# EAGLE design frontend (EAGLE 7.2.0)
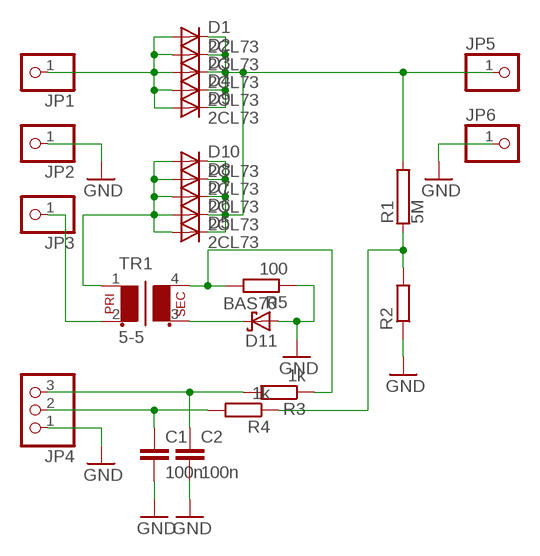
[diagram p0: schematic, sheet 1]

## Parts
C1  100n  C-EUC1206  [C1206]
C2  100n  C-EUC1206  [C1206]
D1  2CL73  [DIODE-3-20]
D2  2CL73  [DIODE-3-20]
D3  2CL73  [DIODE-3-20]
D4  2CL73  [DIODE-3-20]
D5  2CL73  [DIODE-3-20]
D6  2CL73  [DIODE-3-20]
D7  2CL73  [DIODE-3-20]
D8  2CL73  [DIODE-3-20]
D9  2CL73  [DIODE-3-20]
D10  2CL73  [DIODE-3-20]
D11  BAS70  [SOT23]
JP1  PINHD-1X1  [1X01]
JP2  PINHD-1X1  [1X01]
JP3  PINHD-1X1  [1X01]
JP4  PINHD-1X3/90  [1X03/90]
JP5  PINHD-1X1  [1X01]
JP6  PINHD-1X1  [1X01]
R1  5M  RCA4150  [CA4150]
R2  R-EU_R0805  [R0805]
R3  1k  R-EU_R0805  [R0805]
R4  1k  R-EU_R0805  [R0805]
R5  100  R-EU_R0805  [R0805]
TR1  5-5  [RM4-4]

## Nets
GND: C1.2 C2.2 D11.1(A) JP2.1 JP4.1 JP6.1 R2.1 R5.1
N$1: D1.A D2.A D3.A D4.A D9.A JP1.1
N$2: R1.1 R2.2 R4.1
N$3: D5.A D6.A D7.A D8.A D10.A TR1.1
N$4: D1.C D2.C D3.C D4.C D5.C D6.C D7.C D8.C D9.C D10.C JP5.1 R1.2
N$5: C1.1 JP4.2 R4.2
N$6: C2.1 JP4.3 R3.2
N$7: JP3.1 TR1.2
N$8: R3.1 R5.2 TR1.4
N$10: D11.3(C) TR1.3

## Library data of the parts
C1 C2 = resistor:C-EU: CAPACITOR, European symbol
D1-D10 = 50w-modular-psu:2CL*: HIGH VOLTAGE, LOW CURRENT SILICON RECTIFIER DIODES
D11 = diode:BAS70: Silicon Schottky Diodes General-purpose diode for high-speed switching
JP1-JP3 JP5 JP6 = pinhead:PINHD-1X1: PIN HEADER
JP4 = pinhead:PINHD-1X3: PIN HEADER
R1 = resistor-power:R: Power Resitor; OC_FARNELL: unknown; OC_NEWARK: unknown
R2-R5 = resistor:R-EU_: RESISTOR, European symbol
TR1 = 50w-modular-psu:5-5

## Board
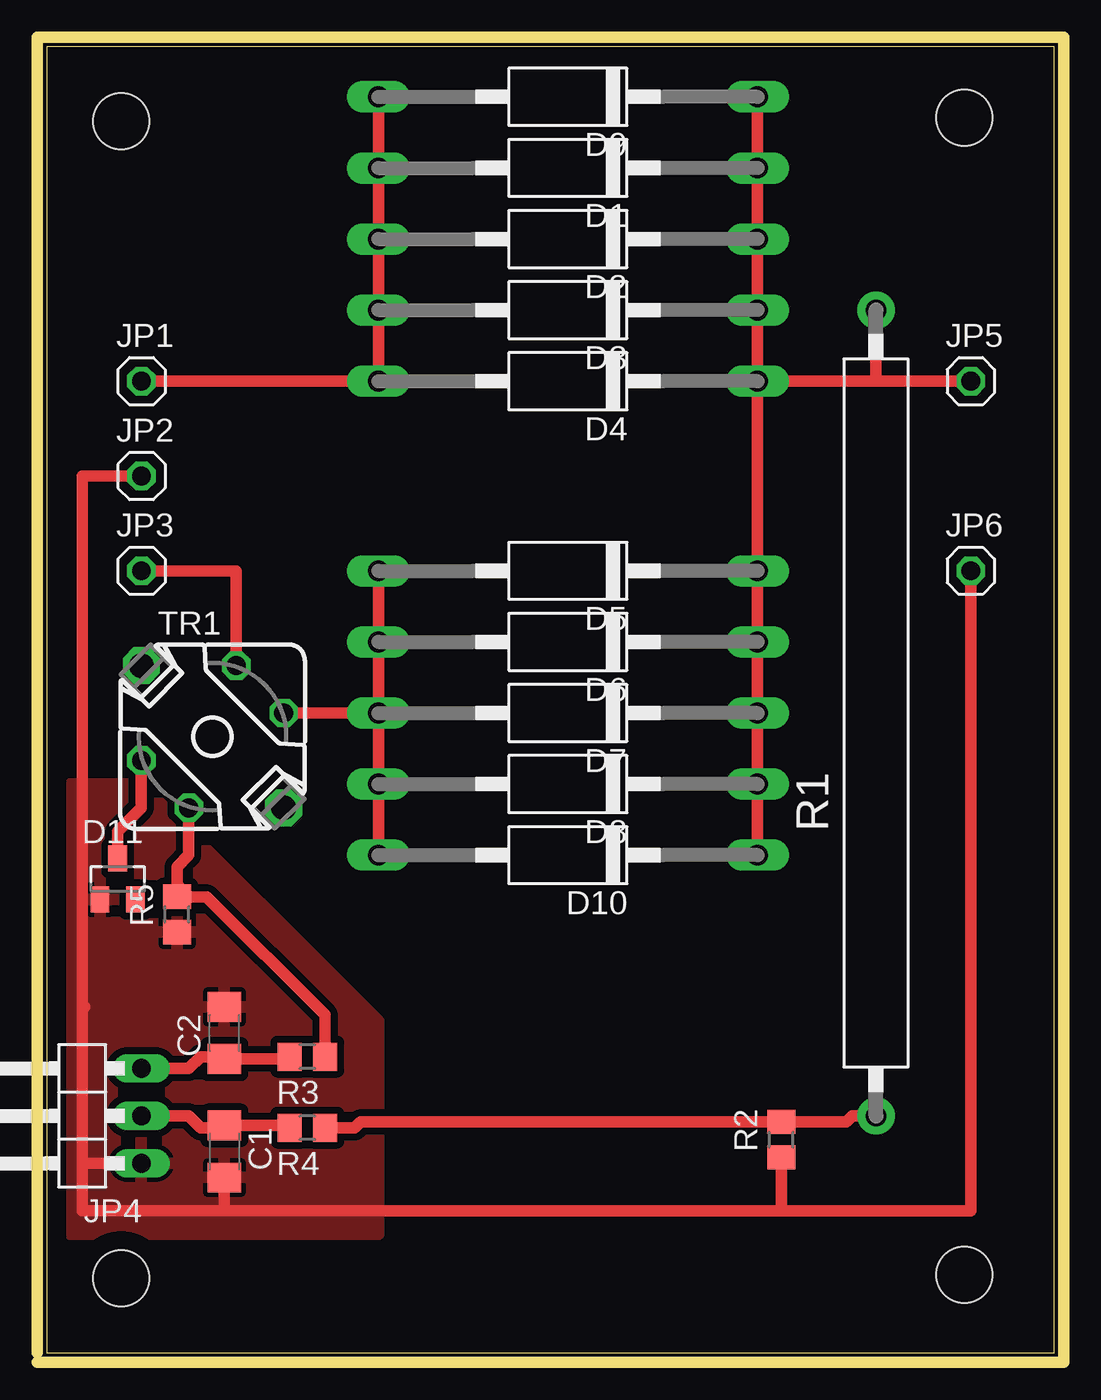
[diagram p1: board, top side]

Size 54 x 70 mm. Coordinates in mm from the lower left corner, seen from the top.
Outline: 0,0 54,0 54,70 0,70 0,0
Copper layers (1*16): Top 0.035mm / dielectric 1.5mm / Bottom 0.035mm
Design rules "default": minimum track width 10mil, minimum drill 24mil, track to track 8mil, track to pad 8mil, pad to pad 8mil, via to via 8mil, smd to smd 8mil, copper to edge 40mil, drill to drill 8mil, minimum pad ring 10mil, minimum via ring 8mil, stop-mask expansion 4mil, vias tented up to drill 0mil, thermal gap 10mil
Holes 3 mm at 4,4 4,66 49.19,4.19 49.19,66.19
Milling: 4 lines

### Footprints (pad centres in the part's own frame; a part is rotated, then mirrored left to right if it is on the bottom)
C1206 = smd 1.6 x 1.8: 1 -1.4,0; 2 1.4,0
DIODE-3-20 = drill 1.118 long: A 10.16,0; C -10.16,0
SOT23 = smd 1 x 1.4: 1 -0.95,-1.1; 2 0.95,-1.1; 3 0,1.1
1X01 = drill 1.016 octagon: 1 0,0
1X03/90 = drill 1.016 long: 1 -2.54,-3.81; 2 0,-3.81; 3 2.54,-3.81
CA4150 = drill 1.1 pad 2: 1 -21.59,0; 2 21.59,0
R0805 = smd 1.3 x 1.5: 1 -0.95,0; 2 0.95,0
RM4-4 = drill 1.016 octagon: 1 -1.27,3.81; 2 -3.81,1.27; 3 1.27,-3.81; 4 3.81,-1.27 | drill 1.321 octagon: M1 -3.81,-3.81; M2 3.81,3.81

### Placement (x,y rotation side)
C1  9.53,10.79 270 top
C2  9.53,17.14 90 top
D1  27.94,63.5 180 top
D2  27.94,59.69 180 top
D3  27.94,55.88 180 top
D4  27.94,52.07 180 top
D5  27.94,41.91 180 top
D6  27.94,38.1 180 top
D7  27.94,34.29 180 top
D8  27.94,30.48 180 top
D9  27.94,67.31 180 top
D10  27.94,26.67 180 top
D11  3.81,25.4 0 top
JP1  5.08,52.07 0 top
JP2  5.08,46.99 0 top
JP3  5.08,41.91 0 top
JP4  1.27,12.7 90 top
JP5  49.53,52.07 0 top
JP6  49.53,41.91 0 top
R1  44.45,34.29 90 top
R2  39.37,11.43 90 top
R3  13.97,15.88 180 top
R4  13.97,12.06 180 top
R5  6.99,23.5 90 top
TR1  8.89,33.02 270 top

### Tracks (layer width: path | path; a pad name or v marks a point on that pad's centre or on a via)
GND
  Top 0.61: 1.91,10.16 1.91,7.62 9.53,7.62 | 1.91,10.16 JP4.1 | JP6.1 49.53,7.62 39.37,7.62 | 39.37,7.62 9.53,7.62 | 1.91,10.16 1.91,18.41 | 1.91,18.41 1.91,46.99 JP2.1 | R2.1 39.37,7.62 | C1.2 9.53,7.62 | 2.04,18.55 1.91,18.41
  pour Top (isolate 0.381): 1.27,6.35 1.27,30.48 5.08,30.48 17.78,17.78 17.78,6.35
N$1
  Top 0.61: JP1.1 D4.A D3.A D2.A D1.A D9.A
N$2
  Top 0.61: R4.1 16.51,12.06 16.82,12.38 R2.2 42.86,12.38 43.18,12.7 R1.1
N$3
  Top 0.61: D5.A D6.A D7.A | D7.A D8.A D10.A | TR1.1 D7.A
N$4
  Top 0.61: D4.C D3.C D2.C D1.C D9.C | D4.C D5.C D6.C D7.C D8.C D10.C | JP5.1 44.45,52.07 | 44.45,52.07 D4.C | R1.2 44.45,52.07
N$5
  Top 0.61: JP4.2 7.62,12.7 8.26,12.06 9.39,12.06 C1.1 12.89,12.2 R4.2
N$6
  Top 0.61: JP4.3 7.62,15.24 8.26,15.88 9.39,15.88 C2.1 12.89,15.74 R3.2
N$7
  Top 0.61: JP3.1 10.16,41.91 TR1.2
N$8
  Top 0.61: TR1.4 7.62,26.67 6.99,26.04 6.99,25.08 7.62,24.45 | R3.1 14.92,18.1 8.57,24.45 7.62,24.45 | R5.2 7.62,24.45
N$10
  Top 0.61: D11.3 3.81,27.94 5.08,29.21 TR1.3